# EAGLE schematic wifi (EAGLE 6.5.0)
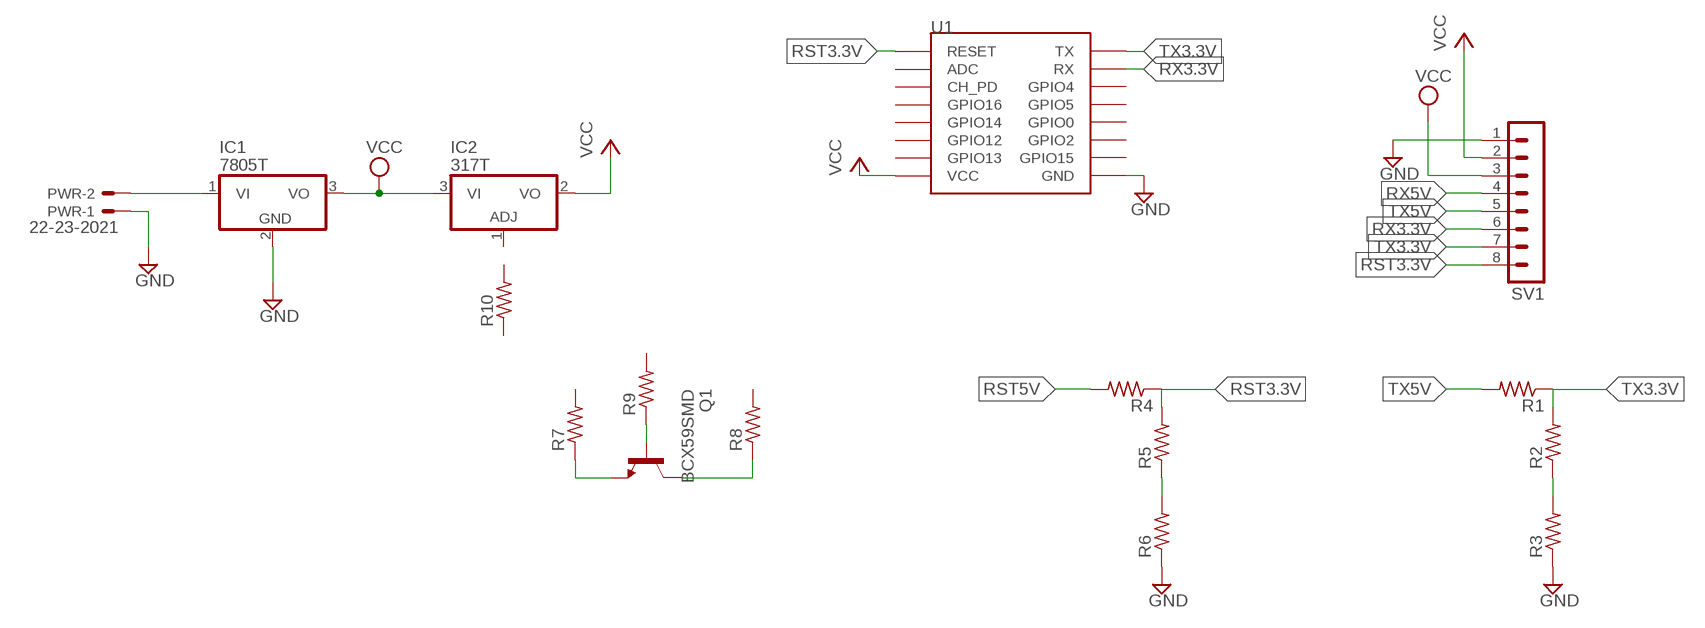
[diagram p0: schematic, sheet 1]

## Parts
IC1  7805T  [TO220H]
IC2  317T  [TO220H]
PWR  22-23-2021  [22-23-2021]
Q1  BCX59SMD  [TO92-EBC]
R1  R-US_M0805  [M0805]
R2  R-US_M0805  [M0805]
R3  R-US_M0805  [M0805]
R4  R-US_M0805  [M0805]
R5  R-US_M0805  [M0805]
R6  R-US_M0805  [M0805]
R7  R-US_M0805  [M0805]
R8  R-US_M0805  [M0805]
R9  R-US_M0805  [M0805]
R10  R-US_0207/10  [0207/10]
SV1  MA08-1  [MA08-1]
U1  ESP12SMD  [ESP12-SMD]

## Nets
3.3V: IC2.2(VO) SV1.2 U1.VCC ; supply symbol labelled VCC
5V: IC1.3(VO) IC2.3(VI) SV1.3 ; supply symbol labelled VCC
GND: IC1.2(GND) PWR.1 R3.1 R6.1 SV1.1 U1.GND
N$1: IC1.1(VI) PWR.2
N$2: R5.1 R6.2
N$3: R2.1 R3.2
N$4: Q1.E R7.1
N$5: Q1.C R8.1
N$6: Q1.B R9.1
RST3.3V: R4.1 R5.2 SV1.8 U1.RESET
RST5V: R4.2
RX3.3V: SV1.6 U1.RXD0(RX)
RX5V: SV1.4
TX3.3V: R1.1 R2.2 SV1.7 U1.TXD0(TX)
TX5V: R1.2 SV1.5
Unconnected: IC2.1(ADJ) R7.2 R8.2 R9.2 R10.1 R10.2 U1.ADC U1.CH_PD U1.GPIO0 U1.GPIO2 U1.GPIO4 U1.GPIO5 U1.GPIO12 U1.GPIO13 U1.GPIO14 U1.GPIO15 U1.GPIO16

## Library data of the parts
IC1 = linear:78*: Positive VOLTAGE REGULATOR Source: http://cache.national.com/ds/LM/LM78L05.pdf http://www.fairchildsemi.com/ds/LM/LM7805.pdf
IC2 = linear:*317: Positive VOLTAGE REGULATOR
PWR = con-molex:22-23-2021: .100" (2.54mm) Center Header - 2 Pin; MF: MOLEX; MPN: 22-23-2021; OC_FARNELL: 1462926; OC_NEWARK: 25C3832
Q1 = transistor-npn:BCX59*: NPN Transistor
R1-R9 = resistor:R-US_: RESISTOR, American symbol
R10 = rcl:R-US_: RESISTOR, American symbol
SV1 = con-lstb:MA08-1: PIN HEADER; OC_FARNELL: unknown; OC_NEWARK: unknown
U1 = esp8266modules:ESP12: ESP8266 Wifi module 12